# EAGLE design hft (EAGLE 6.5.0)
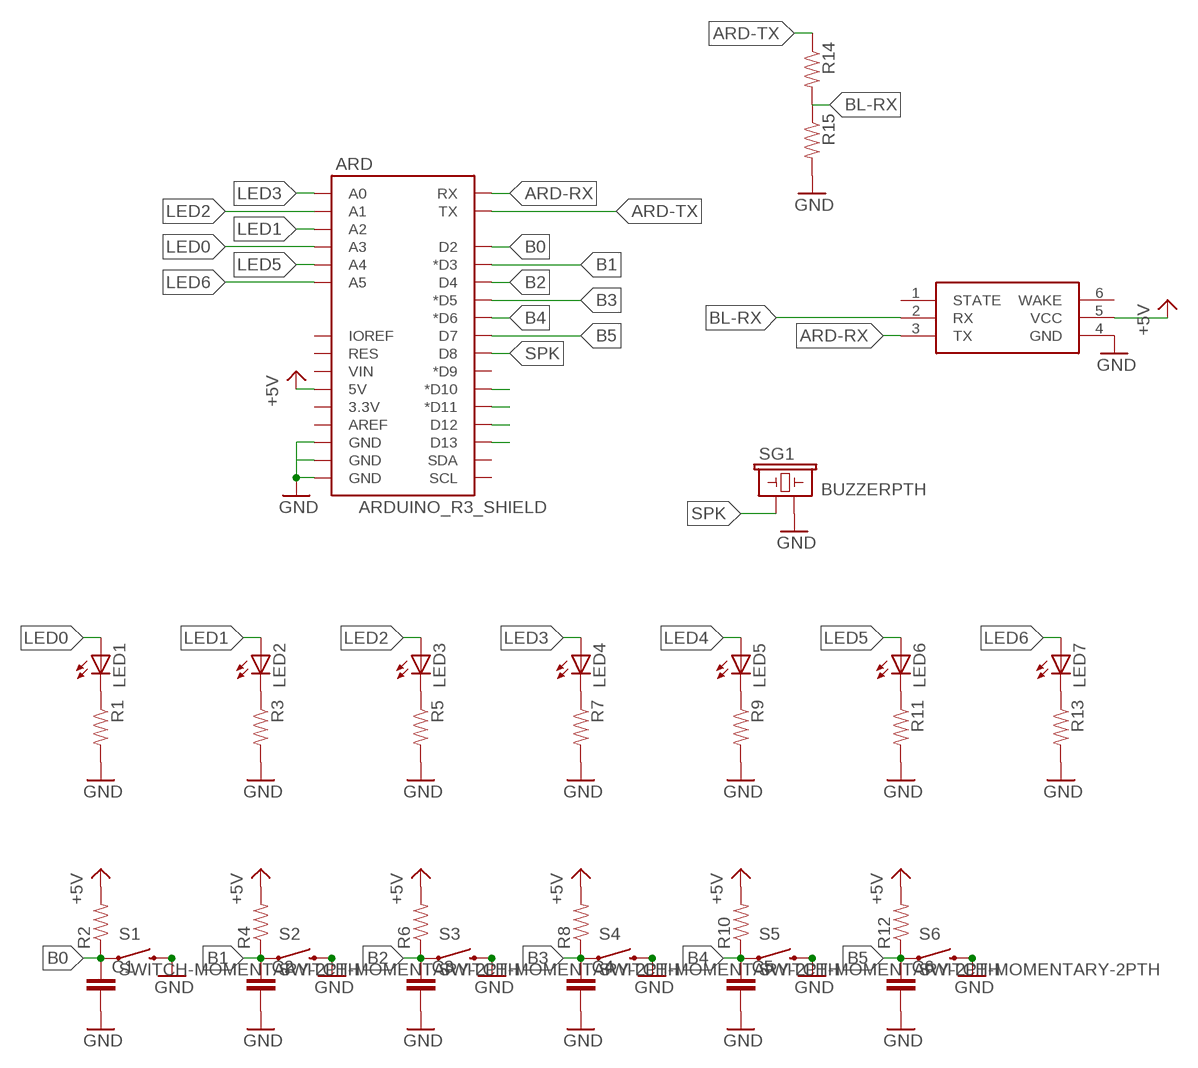
[diagram p0: schematic, sheet 1]

## Parts
ARD  ARDUINO_R3_SHIELD  [UNO_R3_SHIELD]
C1  CAPACITOR0603-CAP  [0603-CAP]
C2  CAPACITOR0603-CAP  [0603-CAP]
C3  CAPACITOR0603-CAP  [0603-CAP]
C4  CAPACITOR0603-CAP  [0603-CAP]
C5  CAPACITOR0603-CAP  [0603-CAP]
C6  CAPACITOR0603-CAP  [0603-CAP]
LED1  LED5MM  [LED5MM]
LED2  LED5MM  [LED5MM]
LED3  LED5MM  [LED5MM]
LED4  LED5MM  [LED5MM]
LED5  LED5MM  [LED5MM]
LED6  LED5MM  [LED5MM]
LED7  LED5MM  [LED5MM]
R1  RESISTOR  [0603-RES]
R2  RESISTOR  [0603-RES]
R3  RESISTOR  [0603-RES]
R4  RESISTOR  [0603-RES]
R5  RESISTOR  [0603-RES]
R6  RESISTOR  [0603-RES]
R7  RESISTOR  [0603-RES]
R8  RESISTOR  [0603-RES]
R9  RESISTOR  [0603-RES]
R10  RESISTOR  [0603-RES]
R11  RESISTOR  [0603-RES]
R12  RESISTOR  [0603-RES]
R13  RESISTOR  [0603-RES]
R14  RESISTOR  [0603-RES]
R15  RESISTOR  [0603-RES]
S1  SWITCH-MOMENTARY-2PTH  [TACTILE-PTH]
S2  SWITCH-MOMENTARY-2PTH  [TACTILE-PTH]
S3  SWITCH-MOMENTARY-2PTH  [TACTILE-PTH]
S4  SWITCH-MOMENTARY-2PTH  [TACTILE-PTH]
S5  SWITCH-MOMENTARY-2PTH  [TACTILE-PTH]
S6  SWITCH-MOMENTARY-2PTH  [TACTILE-PTH]
SG1  BUZZERPTH  [BUZZER-12MM]
U$8  HC-06  [HC-06_BREAKOUT]

## Nets
+5V: ARD.5V R2.2 R4.2 R6.2 R8.2 R10.2 R12.2 U$8.5(VCC)
ARD-RX: ARD.RX U$8.3(TX)
ARD-TX: ARD.TX R14.1
B0: ARD.D2 C1.1 R2.1 S1.1
B1: ARD.D3(*D3) C2.1 R4.1 S2.1
B2: ARD.D4 C3.1 R6.1 S3.1
B3: ARD.D5(*D5) C4.1 R8.1 S4.1
B4: ARD.D6(*D6) C5.1 R10.1 S5.1
B5: ARD.D7 C6.1 R12.1 S6.1
BL-RX: R14.2 R15.1 U$8.2(RX)
GND: ARD.GND@0(GND) ARD.GND@1(GND) ARD.GND@2(GND) C1.2 C2.2 C3.2 C4.2 C5.2 C6.2 R1.2 R3.2 R5.2 R7.2 R9.2 R11.2 R13.2 R15.2 S1.3 S2.3 S3.3 S4.3 S5.3 S6.3 SG1.- U$8.4(GND)
LED0: ARD.A3 LED1.A
LED1: ARD.A2 LED2.A
LED2: ARD.A1 LED3.A
LED3: ARD.A0 LED4.A
LED4: LED5.A
LED5: ARD.A4 LED6.A
LED6: ARD.A5 LED7.A
N$1: LED1.K(C) R1.1
N$2: LED2.K(C) R3.1
N$3: LED3.K(C) R5.1
N$4: LED4.K(C) R7.1
N$5: LED5.K(C) R9.1
N$6: LED6.K(C) R11.1
N$12: LED7.K(C) R13.1
N$21: ARD.D10(*D10)
N$22: ARD.D11(*D11)
N$23: ARD.D12
N$24: ARD.D13
SPK: ARD.D8 SG1.+
Unconnected: ARD.3.3V ARD.AREF ARD.D9(*D9) ARD.IOREF ARD.RES ARD.SCL ARD.SDA ARD.VIN U$8.1(STATE) U$8.6(WAKE)

## Library data of the parts
ARD = hft:ARDUINO_R3_SHIELD: Shield form compatible with the Arduino Uno R3.
C1-C6 = hft:CAPACITOR: Capacitor Basic schematic elements and footprints for capacitors.
LED1-LED7 = hft:LED: LEDs Standard schematic elements and footprints for 5mm, 3mm, 1206, and 0603 sized LEDs. 5mm - Spark Fun Electronics SKU : COM-00529 (and others)
R1-R15 = hft:RESISTOR: Resistor Basic schematic elements and footprints for resistors.
S1-S6 = hft:SWITCH-MOMENTARY-2: Various NO switches- pushbuttons, reed, etc
SG1 = hft:BUZZER: Buzzer 12mm Spark Fun Electronics SKU : Comp-Buzzer
U$8 = hft:HC-06

## Board
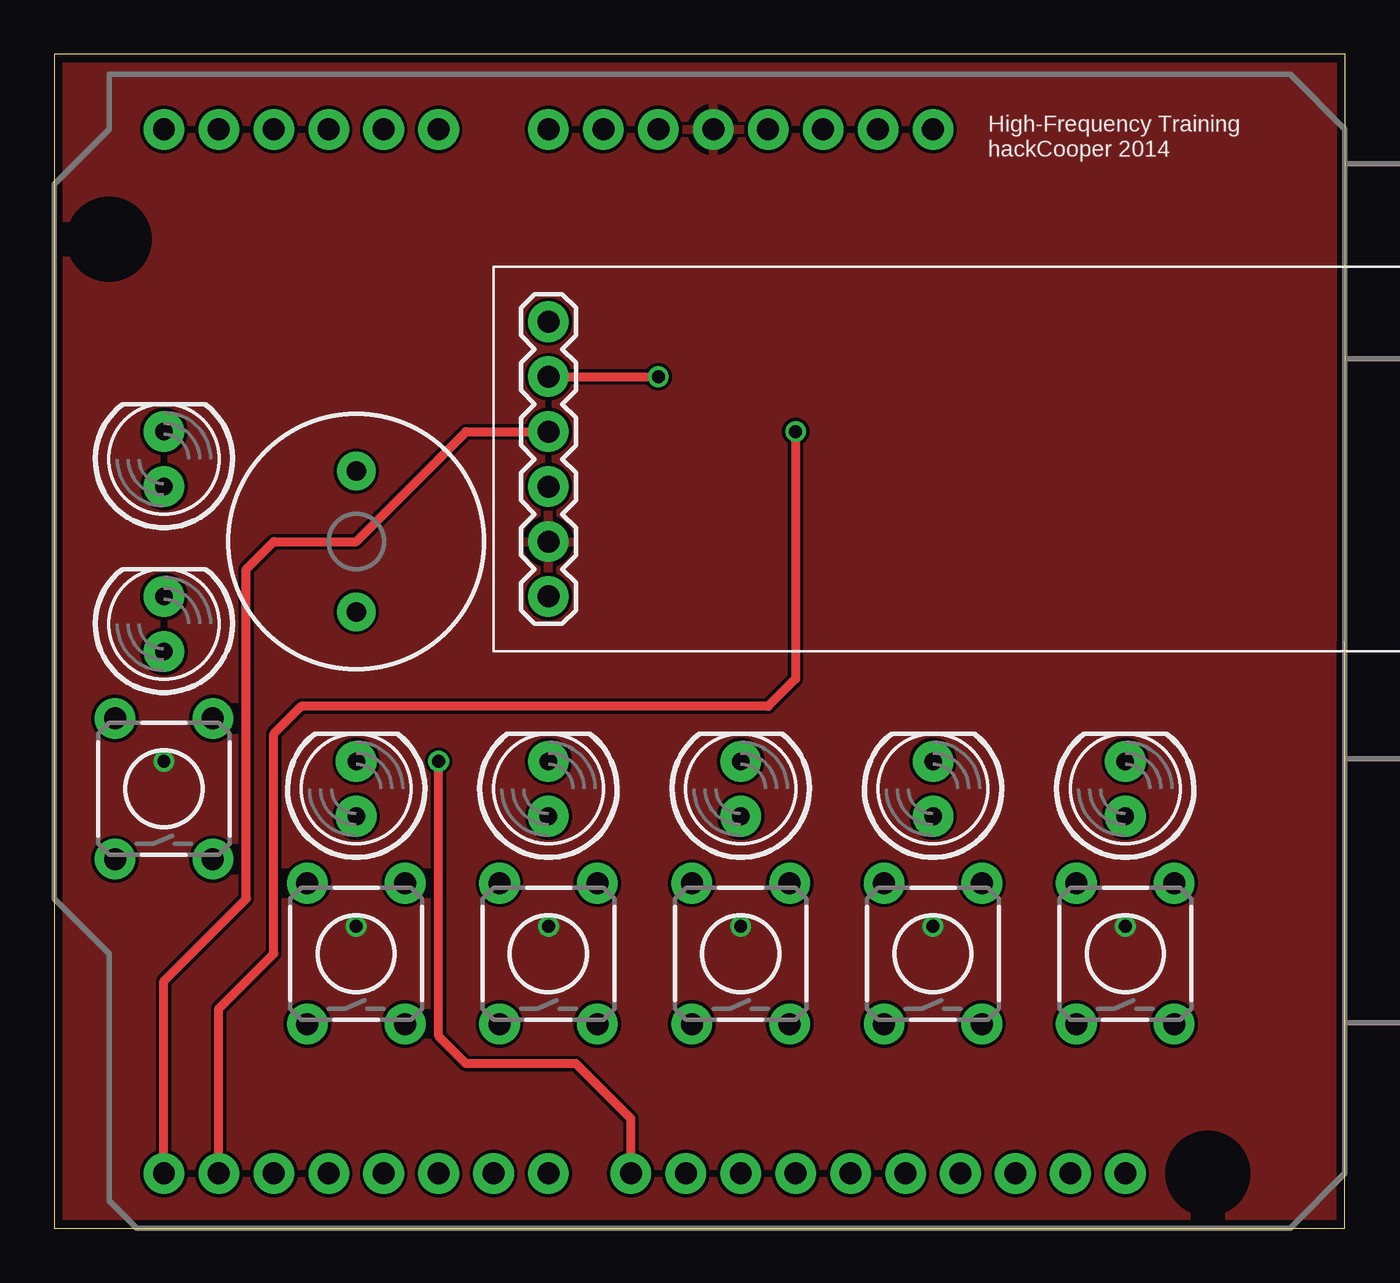
[diagram p1: board, top side]
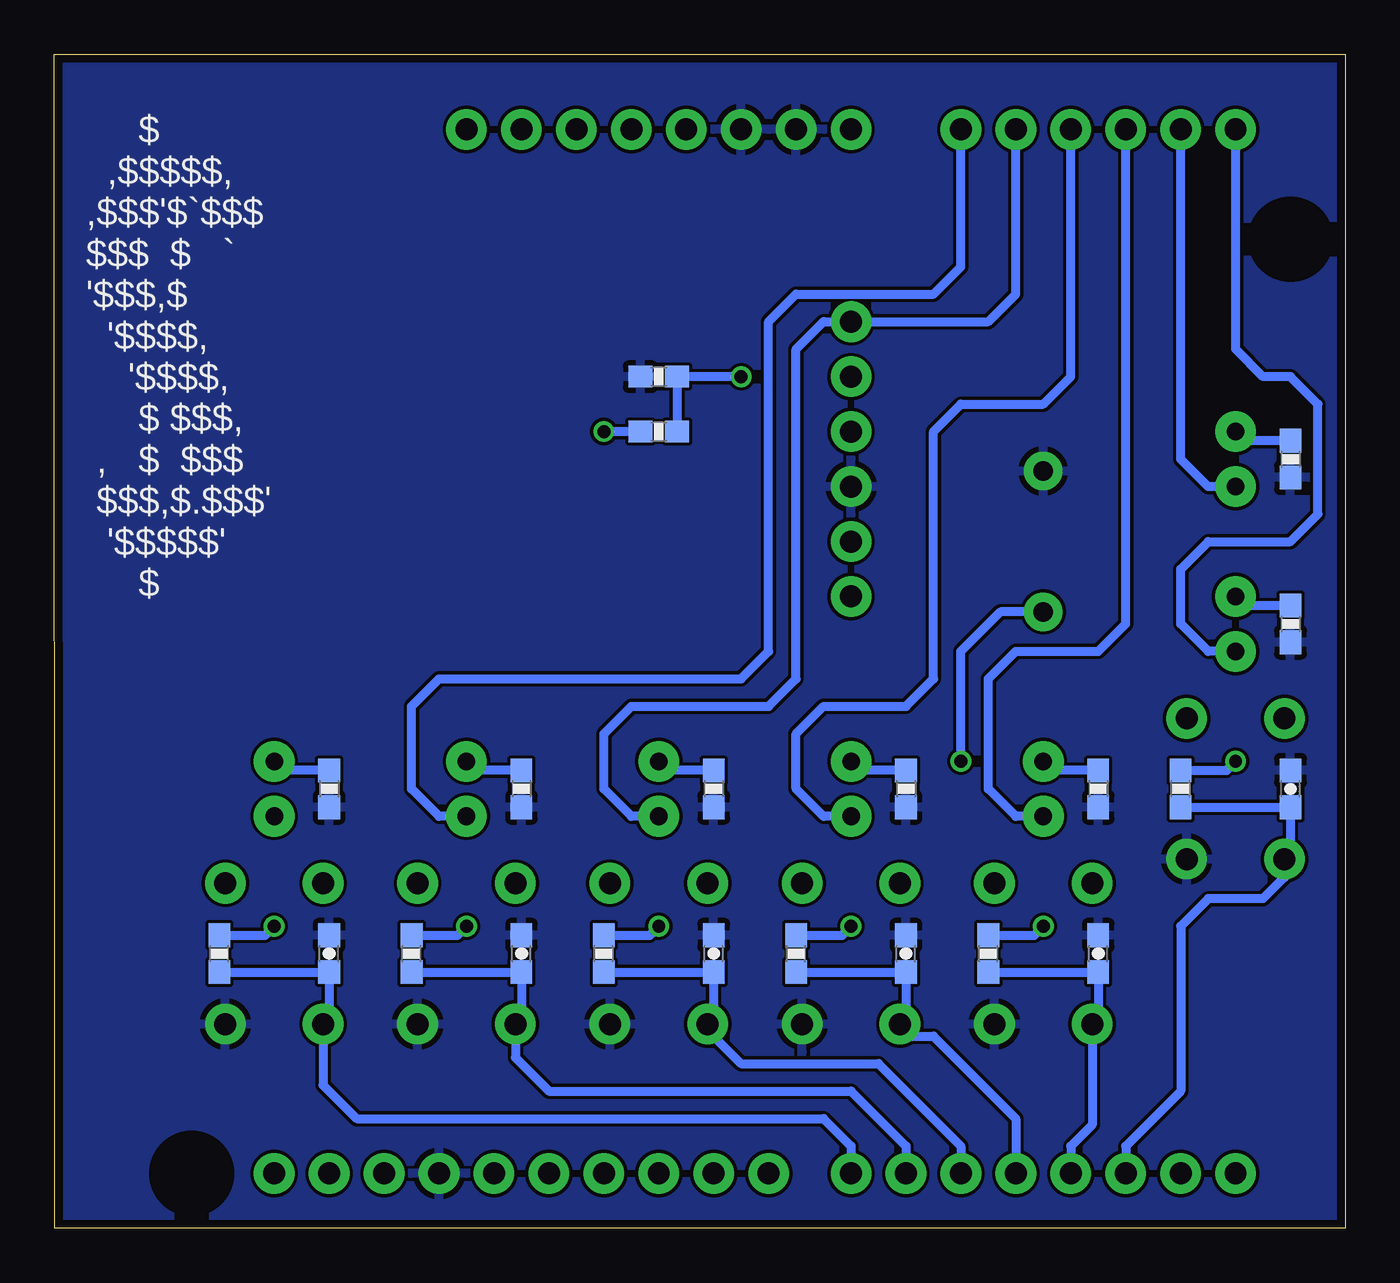
[diagram p2: board, bottom side, seen from below]

Size 59.71 x 54.28 mm. Coordinates in mm from the lower left corner, seen from the top.
Outline: 0,0 59.67,0 59.71,54.28 0,54.28 0,0
Copper layers (1*16): Top 0.0356mm / dielectric 1.5011mm / Bottom 0.0356mm
Design rules "LaenPCBOrder": minimum track width 6mil, minimum drill 13mil, track to track 6mil, track to pad 6mil, pad to pad 6mil, via to via 6mil, smd to smd 6mil, copper to edge 15mil, drill to drill 6mil, minimum pad ring 7mil, minimum via ring 7mil, stop-mask expansion 4mil, vias tented up to drill 0mil, thermal gap 10mil

### Footprints (pad centres in the part's own frame; a part is rotated, then mirrored left to right if it is on the bottom)
UNO_R3_SHIELD = drill 1.016 pad 1.88: 3.3V 50.8,26.67; 5V 50.8,29.21; A0 50.8,41.91; A1 50.8,44.45; A2 50.8,46.99; A3 50.8,49.53; A4 50.8,52.07; A5 50.8,54.61; AREF 2.54,15.24; D2 2.54,49.53; D3 2.54,46.99; D4 2.54,44.45; D5 2.54,41.91; D6 2.54,39.37; D7 2.54,36.83; D8 2.54,33.02; D9 2.54,30.48; D10 2.54,27.94; D11 2.54,25.4; D12 2.54,22.86; D13 2.54,20.32; GND@0 50.8,31.75; GND@1 50.8,34.29; GND@2 2.54,17.78; IOREF 50.8,21.59; NC 50.8,19.05; RES 50.8,24.13; RX 2.54,54.61; SCL 2.54,10.16; SDA 2.54,12.7; TX 2.54,52.07; VIN 50.8,36.83
0603-CAP = smd 1.1 x 1: 1 -0.85,0; 2 0.85,0
LED5MM = drill 0.813 pad 1.88: A -1.27,0; K 1.27,0
0603-RES = smd 1.1 x 1: 1 -0.85,0; 2 0.85,0
TACTILE-PTH = drill 1.016 pad 1.88: 1 -3.251,2.261; 2 3.251,2.261; 3 -3.251,-2.261; 4 3.251,-2.261
BUZZER-12MM = drill 0.9 pad 1.778: + 3.25,0; - -3.25,0
HC-06_BREAKOUT = drill 1.016 pad 1.88: 1 -6.35,0; 2 -3.81,0; 3 -1.27,0; 4 1.27,0; 5 3.81,0; 6 6.35,0

### Placement (x,y rotation side)
ARD  59.69,0 90 top
C1  2.54,20.32 90 bottom
C2  11.43,12.7 90 bottom
C3  20.32,12.7 90 bottom
C4  29.21,12.7 90 bottom
C5  38.1,12.7 90 bottom
C6  46.99,12.7 90 bottom
LED1  13.97,20.32 90 top
LED2  22.86,20.32 90 top
LED3  31.75,20.32 90 top
LED4  40.64,20.32 90 top
LED5  49.53,20.32 90 top
LED6  5.08,35.56 90 top
LED7  5.08,27.94 90 top
R1  11.43,20.32 270 bottom
R2  7.62,20.32 90 bottom
R3  20.32,20.32 270 bottom
R4  16.51,12.7 90 bottom
R5  29.21,20.32 270 bottom
R6  25.4,12.7 90 bottom
R7  38.1,20.32 270 bottom
R8  34.29,12.7 90 bottom
R9  46.99,20.32 270 bottom
R10  43.18,12.7 90 bottom
R11  2.54,35.56 270 bottom
R12  52.07,12.7 90 bottom
R13  2.54,27.94 270 bottom
R14  31.75,36.83 0 bottom
R15  31.75,39.37 180 bottom
S1  5.08,20.32 90 top
S2  13.97,12.7 90 top
S3  22.86,12.7 90 top
S4  31.75,12.7 90 top
S5  40.64,12.7 90 top
S6  49.53,12.7 90 top
SG1  13.97,31.75 270 top
U$8  22.86,35.56 270 top

### Tracks (layer width: path | path; a pad name or v marks a point on that pad's centre or on a via)
+5V  (via drill 0.6)
  Bottom 0.406: R2.2 5.5,21.17 v5.08,21.59 | R4.2 14.39,13.55 v13.97,13.97 | R6.2 23.28,13.55 v22.86,13.97 | R8.2 32.17,13.55 v31.75,13.97 | R10.2 41.06,13.55 v40.64,13.97 | R12.2 49.95,13.55 v49.53,13.97
  pour Top: -1.27,-2.54 -1.27,55.88 60.96,55.88 60.96,-2.54
ARD-RX
  Top 0.406: ARD.RX 5.08,11.43 8.89,15.24 8.89,30.48 10.16,31.75 13.97,31.75 19.05,36.83 U$8.3
ARD-TX  (via drill 0.6)
  Top 0.406: ARD.TX 7.62,10.16 10.16,12.7 10.16,22.86 11.43,24.13 33.02,24.13 34.29,25.4 v34.29,36.83
  Bottom 0.406: R14.1 v34.29,36.83
B0
  Bottom 0.406: ARD.D2 10.16,3.81 7.62,6.35 7.62,13.97 6.35,15.24 3.81,15.24 2.82,16.23 S1.1 2.54,17.35 C1.1 R2.1
B1
  Bottom 0.406: R4.1 C2.1 11.43,9.73 S2.1 11.71,4.8 12.7,3.81 ARD.D3
B2
  Bottom 0.406: ARD.D4 15.24,5.08 19.05,8.89 20.04,8.89 S3.1 20.32,9.73 C3.1 R6.1
B3
  Bottom 0.406: ARD.D5 17.78,3.81 21.59,7.62 27.94,7.62 29.49,9.17 S4.1 29.21,9.73 C4.1 R8.1
B4
  Bottom 0.406: ARD.D6 20.32,3.81 22.86,6.35 36.83,6.35 38.38,7.9 S5.1 38.1,9.73 C5.1 R10.1
B5
  Bottom 0.406: ARD.D7 22.86,3.81 24.13,5.08 45.72,5.08 47.27,6.63 S6.1 46.99,9.73 C6.1 R12.1
BL-RX  (via drill 0.6)
  Top 0.406: U$8.2 v27.94,39.37
  Bottom 0.406: v27.94,39.37 R15.1 R14.2
GND
  pour Bottom: -1.27,-2.54 -1.27,55.88 60.96,55.88 60.96,-2.54
LED0
  Bottom 0.406: LED1.A 15.24,19.05 16.51,20.32 16.51,25.4 15.24,26.67 11.43,26.67 10.16,27.94 ARD.A3
LED1
  Bottom 0.406: LED2.A 24.13,19.05 25.4,20.32 25.4,22.86 24.13,24.13 20.32,24.13 19.05,25.4 19.05,36.83 17.78,38.1 13.97,38.1 12.7,39.37 ARD.A2
LED2
  Bottom 0.406: LED3.A 33.02,19.05 34.29,20.32 34.29,22.86 33.02,24.13 26.67,24.13 25.4,25.4 25.4,40.64 24.13,41.91 16.51,41.91 15.24,43.18 ARD.A1
LED3
  Bottom 0.406: LED4.A 41.91,19.05 43.18,20.32 43.18,24.13 41.91,25.4 27.94,25.4 26.67,26.67 26.67,41.91 25.4,43.18 19.05,43.18 17.78,44.45 ARD.A0
LED5
  Bottom 0.406: LED6.A 6.35,34.29 7.62,35.56 ARD.A4
LED6
  Bottom 0.406: LED7.A 6.35,26.67 7.62,27.94 7.62,30.48 6.35,31.75 2.54,31.75 1.27,33.02 1.27,38.1 2.54,39.37 3.81,39.37 5.08,40.64 ARD.A5
N$1
  Bottom 0.406: R1.1 13.55,21.17 LED1.K
N$2
  Bottom 0.406: R3.1 22.44,21.17 LED2.K
N$3
  Bottom 0.406: R5.1 31.33,21.17 LED3.K
N$4
  Bottom 0.406: R7.1 40.22,21.17 LED4.K
N$5
  Bottom 0.406: R9.1 49.11,21.17 LED5.K
N$6
  Bottom 0.406: R11.1 4.66,36.41 LED6.K
N$12
  Bottom 0.406: R13.1 4.66,28.79 LED7.K
SPK  (via drill 0.6)
  Top 0.406: ARD.D8 26.67,5.08 24.13,7.62 19.05,7.62 17.78,8.89 v17.78,21.59
  Bottom 0.406: v17.78,21.59 17.78,26.67 15.95,28.5 SG1.+

### Text on the board
tPlace: High-Frequency Training / hackCooper 2014
bPlace: $ / ,$$$$$, / ,$$$'$`$$$ / $$$ $ ` / '$$$,$ / '$$$$, / '$$$$, / $ $$$, / , $ $$$ / $$$,$.$$$' / '$$$$$' / $